# Altium schematic sheet IIC_LCD.SchDoc
size A3
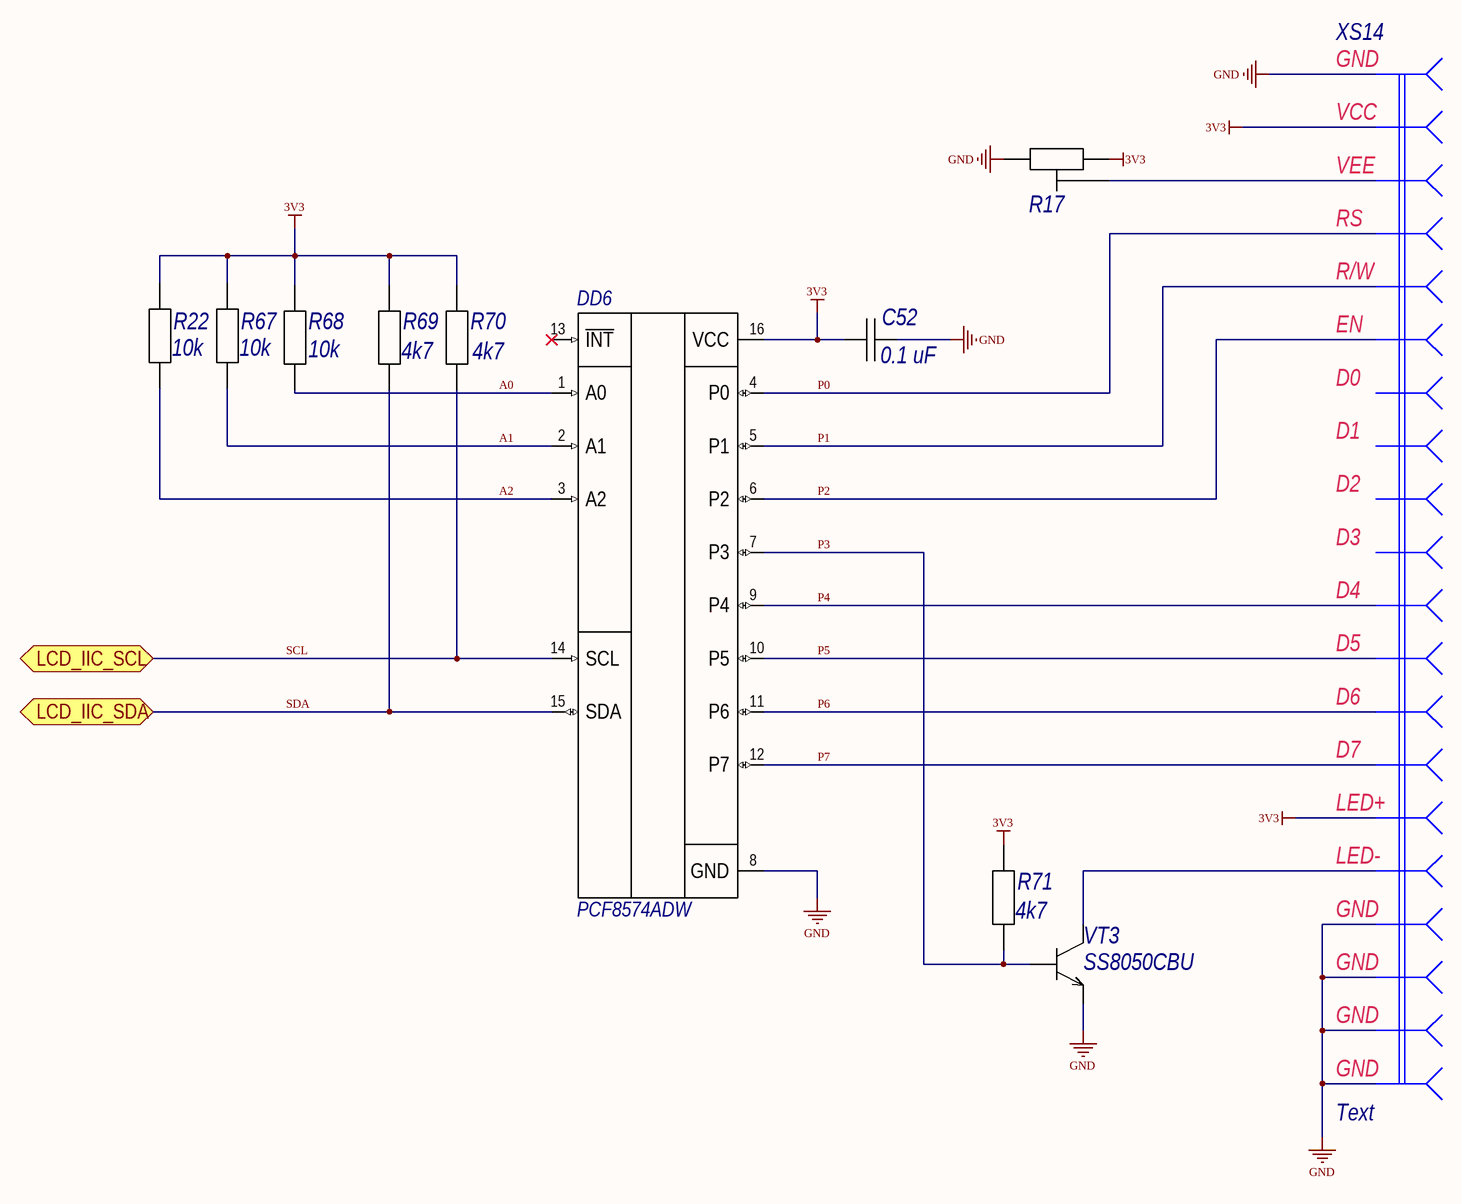
[diagram p0: IIC_LCD.SchDoc]

## Parts
C52  0.1 uF  [C0805C]
DD6  PCF8574ADW  [SOIC127P1030X265-16N]
R17  RES_VAR  [TRIM_3296W-1-254LF]  (value not drawn)
R22  10k  [C0805R]
R67  10k  [C0805R]
R68  10k  [C0805R]
R69  4k7  [C0805R]
R70  4k7  [C0805R]
R71  4k7  [C0805R]
VT3  SS8050CBU  [TO-92-A]
XS14  Text  [IDC-20]

## Ports
LCD_IIC_SCL (bidir), LCD_IIC_SDA (bidir)

## Nets
3V3: C52.2 DD6.16(VCC) R17.1 R22.2 R67.2 R68.2 R69.2 R70.2 R71.2 XS14.2 XS14.15
GND: C52.1 DD6.8(GND) R17.3 VT3.3(Э) XS14.1 XS14.17 XS14.18 XS14.19 XS14.20
A0: DD6.1(A0) R68.1
A1: DD6.2(A1) R67.1
A2: DD6.3(A2) R22.1
P0: DD6.4(P0) XS14.4
P1: DD6.5(P1) XS14.5
P2: DD6.6(P2) XS14.6
P3: DD6.7(P3) R71.1 VT3.1(Б)
P4: DD6.9(P4) XS14.11
P5: DD6.10(P5) XS14.12
P6: DD6.11(P6) XS14.13
P7: DD6.12(P7) XS14.14
SCL: DD6.14(SCL) R70.1 ; port LCD_IIC_SCL
SDA: DD6.15(SDA) R69.1 ; port LCD_IIC_SDA
NetR17_2: R17.2 XS14.3
NetVT3_2: VT3.2(К) XS14.16

Not connected (* = marked no-connect by the designer): DD6 13(~{INT})*; XS14 7 8 9 10

## Notes on the sheet
- (in symbol CONNECT_LCD) GND; VCC; VEE; RS; R/W; EN; D0; D1; D2; D3; D4; D5; D6; D7; LED+; LED-

## Library data of the parts
C52 = CAP_0805: Type: Конденсатор; Published: 18.05.2010; Publisher: Andrew Danich
DD6 = PCF8574ADW: Remote 8-Bit I/O Expander for I2C-Bus 16-SOIC -40 to 85; MF: Texas Instruments; Mouser-Purchase-URL: https://snapeda.com/shop?store=Mouser&id=554599; SnapEDA_Link: https://www.snapeda.com/parts/PCF8574ADW/Texas%20Instruments/view-part/554599/?ref=snap; DigiKey-Purchase-URL: https://snapeda.com/shop?store=DigiKey&id=554599; Package: SOIC-16 Texas Instruments; MP: PCF8574ADW; Price: None; Availability: Warning; Texas_Instruments-Purchase-URL: https://snapeda.com/shop?store=Texas+Instruments&id=554599; Value: *
R22 R67-R71 = RES_0805: Published: 24.03.2010; Publisher: Andrew Danich; Type: Резистор
VT3 = SS8050CBU: Type: Транзистор; Published: 07.05.2013; Publisher: Andrew Danich
XS14 = CONNECT_LCD: Value: Connector; Published: 07.03.2013; Publisher: Andrew Danich; Type: Розетка
R17 = RES_VAR: Publisher: Andrew Danich; Type: Подстроечный резистор; Published: 27.07.2015